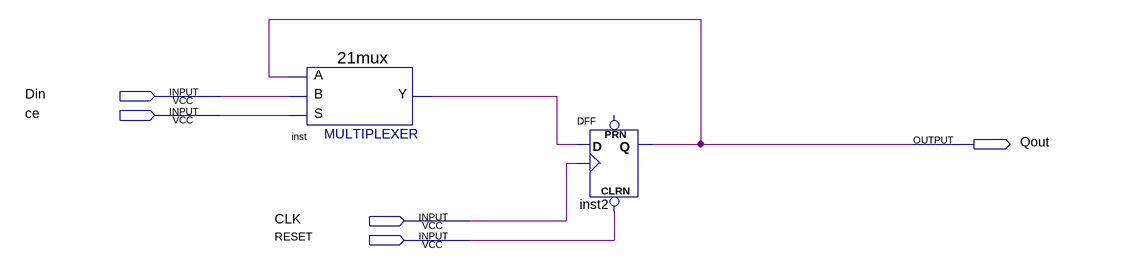
[diagram p0: schematic sheet]
// Quartus schematic hw3_2.bdf as structural Verilog: 2 symbols, 5 pins
module hw3_2 (
  input  Din,
  input  ce,
  input  CLK,
  input  RESET,
  output Qout
);

  wire inst_y;

  \21mux  inst (.S(ce), .B(Din), .A(Qout), .Y(inst_y));
  DFF inst2 (.CLRN(RESET), .CLK(CLK), .D(inst_y), .Q(Qout));  // open: PRN
endmodule
